# EAGLE design FTDI-Breakout_v30 (EAGLE 7.7.0)
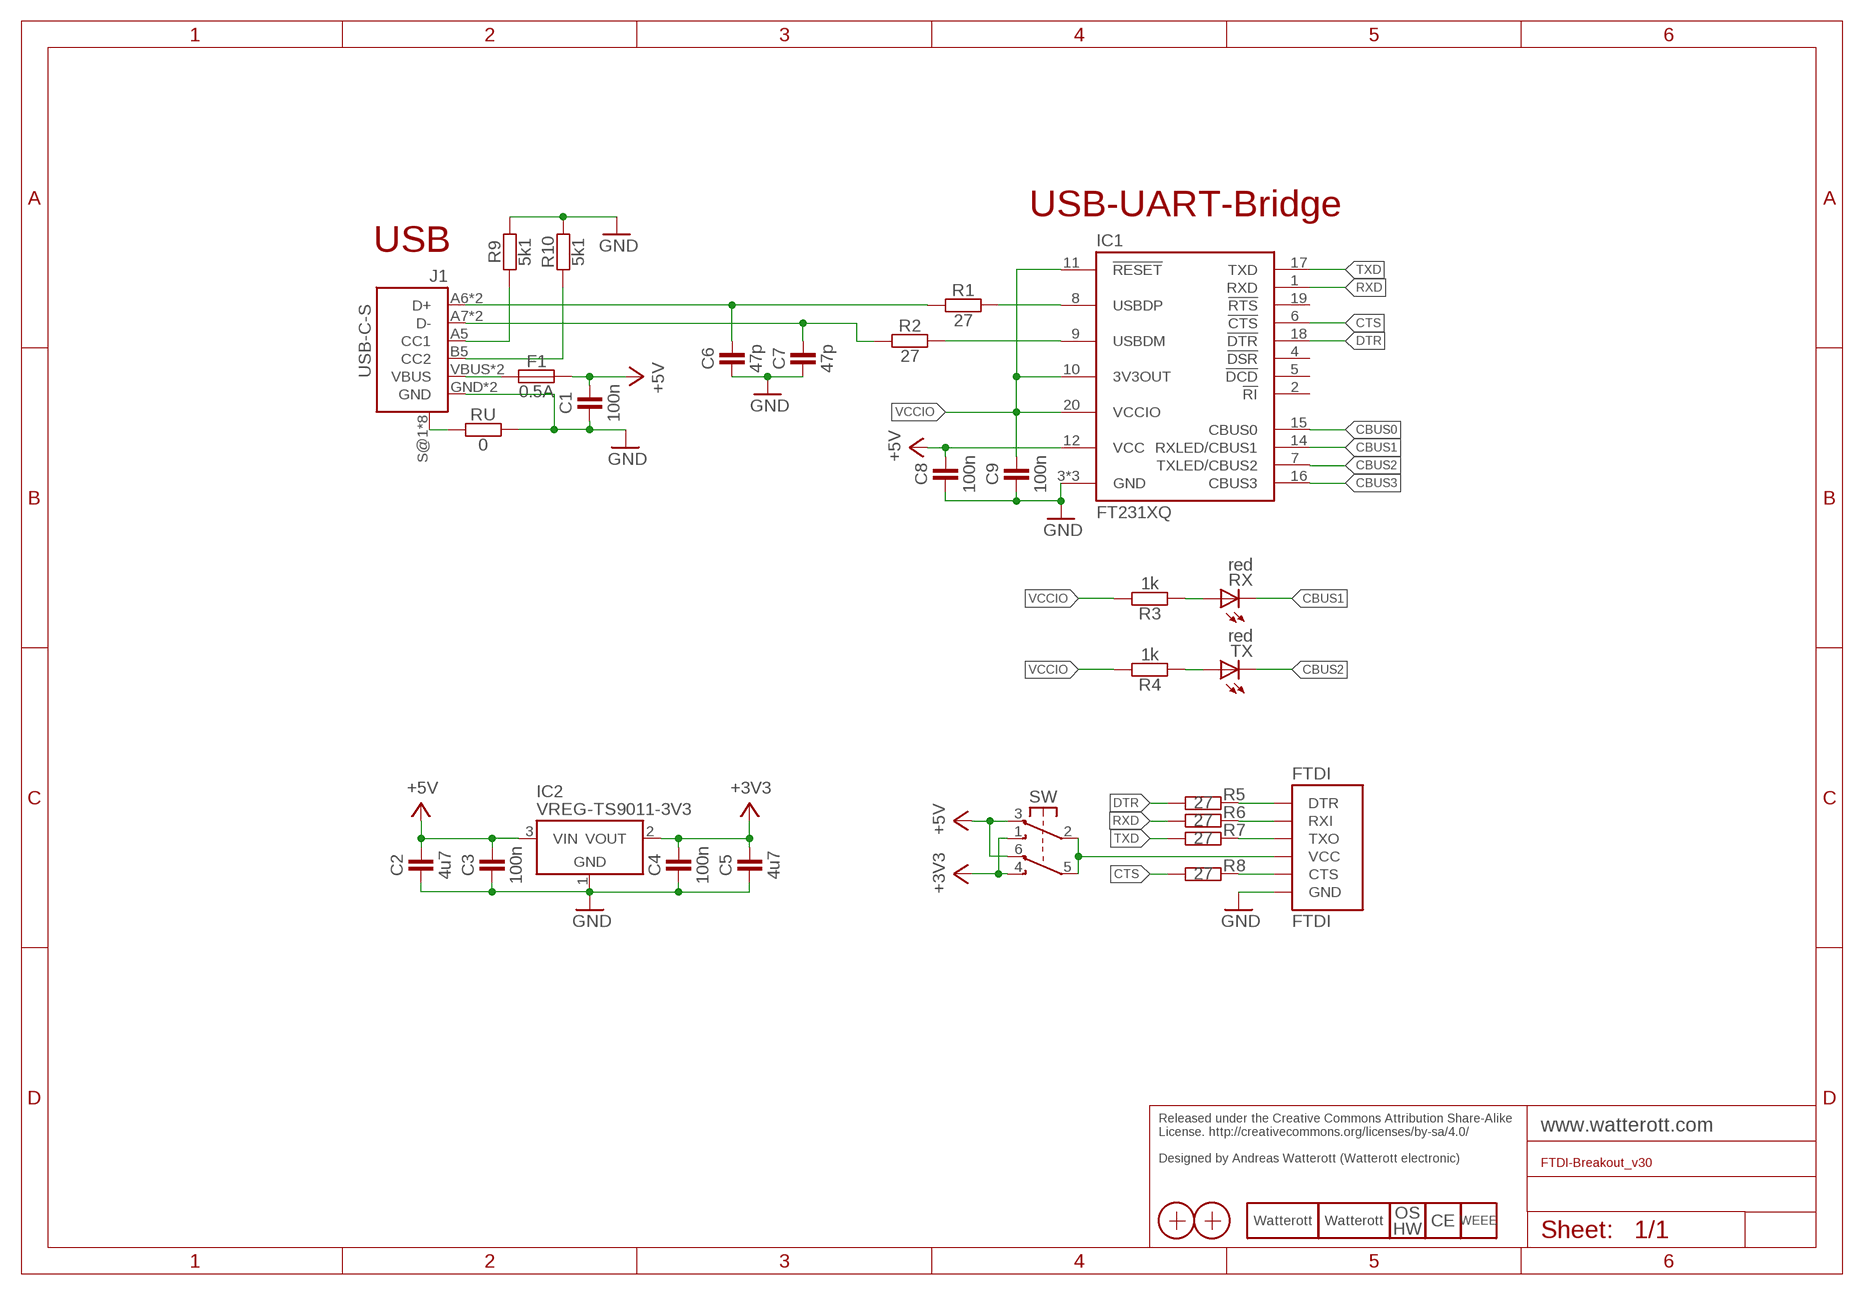
[diagram p0: schematic, sheet 1]

## Parts
C1  100n  CAPACITOR-0603  [C0603]
C2  4u7  CAPACITOR-0805  [C0805]
C3  100n  CAPACITOR-0603  [C0603]
C4  100n  CAPACITOR-0603  [C0603]
C5  4u7  CAPACITOR-0805  [C0805]
C6  47p  CAPACITOR-0603  [C0603]
C7  47p  CAPACITOR-0603  [C0603]
C8  100n  CAPACITOR-0603  [C0603]
C9  100n  CAPACITOR-0603  [C0603]
F1  0.5A  FUSE-0805  [C0805]
FTDI  FTDI  [FTDI]
IC1  FT231XQ  [QFN20-PAD]
IC2  VREG-TS9011-3V3  [SOT23]
J1  USB-C-S  [USB-C-S]
LOGO5  LOGO_SPARK-2  [SPARK_2MM]
LOGO6  LOGO_SPARK-4  [SPARK_4MM]
LOGO7  LOGO_OSHW-2  [OSHW_2MM]
LOGO8  LOGO_CE-2  [CE_2MM]
LOGO9  LOGO_WEEE-4  [WEEE_4MM]
R1  27  RESISTOR-0603  [C0603]
R2  27  RESISTOR-0603  [C0603]
R3  1k  RESISTOR-0603  [C0603]
R4  1k  RESISTOR-0603  [C0603]
R5  27  RESISTOR-0603  [C0603]
R6  27  RESISTOR-0603  [C0603]
R7  27  RESISTOR-0603  [C0603]
R8  27  RESISTOR-0603  [C0603]
R9  5k1  RESISTOR-0603  [C0603]
R10  5k1  RESISTOR-0603  [C0603]
RU  0  RESISTOR-0603  [C0603]
RX  red  LED-0603  [C0603]
SW  SW-2UM-CUS22B  [CUS22B]
TX  red  LED-0603  [C0603]
X1  PASSER-07  [PASSER_07MM]
X2  PASSER-07  [PASSER_07MM]

## Nets
+3V3: C4.2 C5.2 IC2.2(VOUT) SW.1(NO1) SW.4(NO2)
+5V: C1.2 C2.2 C3.2 C8.2 F1.2 IC1.12(VCC) IC2.3(VIN) SW.3(NC1) SW.6(NC2)
CBUS0: IC1.15(CBUS0)
CBUS1: IC1.14(RXLED/CBUS1) RX.C
CBUS2: IC1.7(TXLED/CBUS2) TX.C
CBUS3: IC1.16(CBUS3)
CC1: J1.A5(CC1) R9.1
CC2: J1.B5(CC2) R10.1
CTS: IC1.6(!CTS) R8.1
D2_N: IC1.9(USBDM) R2.2
D2_P: IC1.8(USBDP) R1.2
D_N: C7.2 J1.A7(D-) J1.B7(D-) R2.1
D_P: C6.2 J1.A6(D+) J1.B6(D+) R1.1
DTR: IC1.18(!DTR) R5.1
FTDI-CTS: FTDI.2-CTS(CTS) R8.2
FTDI-DTR: FTDI.6-DTR(DTR) R5.2
FTDI-RXI: FTDI.5-RXI(RXI) R6.2
FTDI-TXO: FTDI.4-TXO(TXO) R7.2
FTDI-VCC: FTDI.3-VCC(VCC) SW.2(C1) SW.5(C2)
GND: C1.1 C2.1 C3.1 C4.1 C5.1 C6.1 C7.1 C8.1 C9.1 FTDI.1-GND(GND) IC1.3(GND) IC1.13(GND) IC1.TP(GND) IC2.1(GND) J1.GND J1.GND2(GND) R9.2 R10.2 RU.2
RX-LED: R3.1 RX.A
RXD: IC1.1(RXD) R6.1
SHLD: J1.S@1(SHIELD) J1.S@2(SHIELD) J1.S@3(SHIELD) J1.S@4(SHIELD) J1.S@5(SHIELD) J1.S@6(SHIELD) J1.S@7(SHIELD) J1.S@8(SHIELD) RU.1
TX-LED: R4.1 TX.A
TXD: IC1.17(TXD) R7.1
VBUS: F1.1 J1.VBUS J1.VBUS2(VBUS)
VCCIO: C9.2 IC1.10(3V3OUT) IC1.11(!RESET) IC1.20(VCCIO) R3.2 R4.2
Unconnected: IC1.2(!RI) IC1.4(!DSR) IC1.5(!DCD) IC1.19(!RTS)

## Notes on the sheet
- USB-UART-Bridge
- USB
- Released under the Creative Commons Attribution Share-Alike 
  License. http://creativecommons.org/licenses/by-sa/4.0/
  
  Designed by Andreas Watterott (Watterott electronic)

## Library data of the parts
C1-C9 = we-rcl:CAPACITOR: Capacitor ...2.2uF @ 6.3V -> 0402 ...4.7uF @ 6.3V -> 0603 ...10uF @ 16V -> 0805 ...22uF @ 25V -> 1206
F1 = we-rcl:FUSE: Fuse Polyfuses 0805 - 0.5A or 1A, 6V 1206 - 2A, 6V 1812 - 1A or 2A, 16V
FTDI = we-board:FTDI: FTDI 6pol connector
IC1 = we-chip:FT231X: FTDI FT231X USB to UART Bridge (5V tolerant inputs); DIGIKEY: 768-1128-6-ND
IC2 = we-power:VREG: Voltage Regulator LDOs Taiwan Semi TS1117 800mA max 15V - compatible On Semi NCP1117 1A max 20V - compatible Diodes AP2111H 0.6A max 6V (0.25V@0.6A) - compatible Diodes AP2114H 1A max 6V (0.45V@1A) Taiwan Semi TS9011 250mA max 12V - compatible Diodes AP2210 300mA max 15V - compatible Microchip MCP1700 250mA max 6.5V - compatible Microchip MCP1702 250mA max 13V - compatible Microchip MCP1703 250mA max 16V - compatible Microchip MCP1754 150mA max 16V Taiwan Semi TS5204 80mA max 16V (low noise) DC/DC Converter Modules Recom R-78Ex.x-1.0-W36 1A max 28V - compatible CUI V78xx-2000 2A max 18V Murata OKI-78SR-x.x/1.5-W36 1.5A max 36V
J1 = we-con:USB-C: USB-C Connector Hroparts TYPE-C-31-M-12 or Jing C167321 or XKB U262-161N-4BVC11 Up: XKB U263-241N-4BQC11-1 or Wuerth 632722110112
LOGO5 LOGO6 = we-symbol:LOGO_SPARK: Watterott electronic Logo
LOGO7 = we-symbol:LOGO_OSHW: Open-Source-Hardware Logo
LOGO8 = we-symbol:LOGO_CE: CE Logo
LOGO9 = we-symbol:LOGO_WEEE: WEEE Logo
R1-R10 RU = we-rcl:RESISTOR: Resistor all kinds in 0402 and 0603
RX TX = we-opto:LED: LED red, green, blue -> 0603
SW = we-switch:SW-2UM: Switch; DIGIKEY: 563-1105-6-ND
X1 X2 = we-symbol:PASSER: Fiducial Marker

## Board
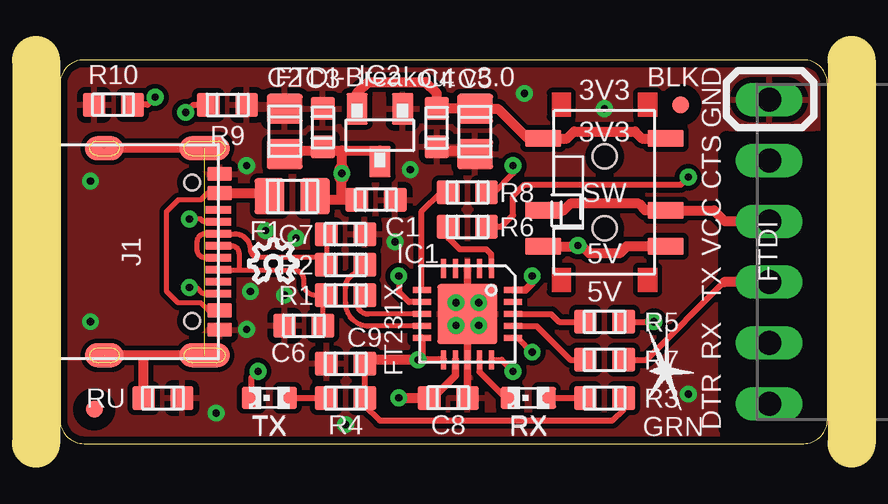
[diagram p1: board, top side]
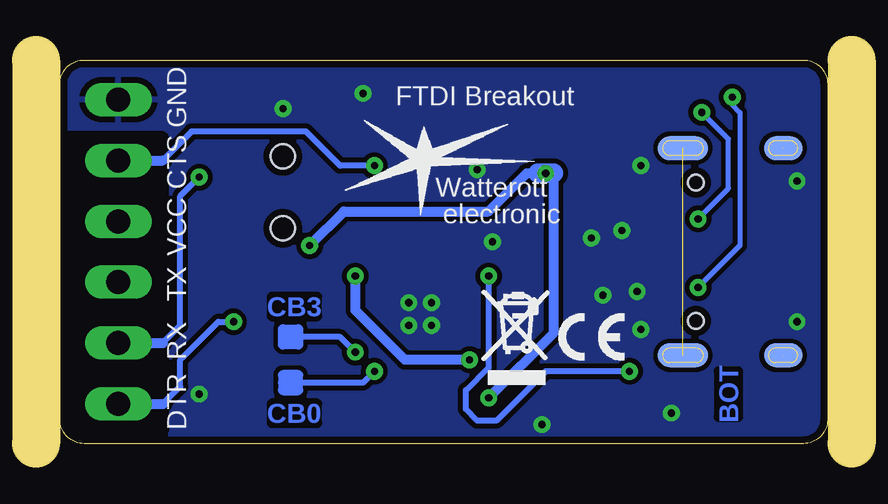
[diagram p2: board, bottom side, seen from below]

Size 32 x 16 mm. Coordinates in mm from the lower left corner, seen from the top.
Outline: 0,1 arc90 1,0 31,0 arc90 32,1 32,15 arc90 31,16 1,16 arc90 0,15 0,1
Copper layers (1*16): Top 0.035mm / dielectric 1.5mm / Bottom 0.035mm
Design rules "we-dru-2-layer *": minimum track width 0.15mm, minimum drill 0.3mm, track to track 0.15mm, track to pad 0.15mm, pad to pad 0.15mm, via to via 0.15mm, smd to smd 0.1mm, copper to edge 0.3mm, drill to drill 0.2mm, minimum pad ring 0.18mm, minimum via ring 0.2mm, stop-mask expansion 0.1mm, vias tented up to drill 0.5mm, thermal gap 0.25mm
tRestrict: area 27.8,0.6 to 31.6,12.7
bRestrict: area 27.8,0.6 to 31.6,12.7
Milling: 2 lines

### Footprints (pad centres in the part's own frame; a part is rotated, then mirrored left to right if it is on the bottom)
C0603 = smd 1 x 0.95: 1 0,0.8; 2 0,-0.8
C0805 = smd 1.5 x 1.25: 1 0,0.95; 2 0,-0.95
FTDI = drill 1 long: 1-GND 0,6.35; 2-CTS 0,3.81; 3-VCC 0,1.27; 4-TXO 0,-1.27; 5-RXI 0,-3.81; 6-DTR 0,-6.35
QFN20-PAD = smd 0.8 x 0.26: 1 -1.9,1; 2 -1.9,0.5; 3 -1.9,0; 4 -1.9,-0.5; 5 -1.9,-1; 11 1.9,-1; 12 1.9,-0.5; 13 1.9,0; 14 1.9,0.5; 15 1.9,1 | smd 0.26 x 0.8: 6 -1,-1.9; 7 -0.5,-1.9; 8 0,-1.9; 9 0.5,-1.9; 10 1,-1.9; 16 1,1.9; 17 0.5,1.9; 18 0,1.9; 19 -0.5,1.9; 20 -1,1.9 | smd 2.5 x 2.5: TP 0,0
SOT23 = smd 1.3 x 0.9: 1 -1.1,0.95; 2 -1.1,-0.95; 3 1.1,0
USB-C-S = smd 1.1 x 0.3: A5 -1.105,-1.25; A6 -1.105,-0.25; A7 -1.105,0.25; A8 -1.105,1.25; B5 -1.105,1.75; B6 -1.105,0.75; B7 -1.105,-0.75; B8 -1.105,-1.75 | smd 1 x 0.6: GND -1.155,3.25; GND2 -1.155,-3.25; VBUS -1.155,2.45; VBUS2 -1.155,-2.45 | smd 2.1 x 1: S@1 -0.53,4.32; S@5 -0.53,-4.32 | smd 2.1 x 1 bottom: S@2 -0.53,4.32; S@6 -0.53,-4.32 | smd 1.6 x 1: S@3 3.65,4.32; S@7 3.65,-4.32 | smd 1.6 x 1 bottom: S@4 3.65,4.32; S@8 3.65,-4.32 | hole 0.65: 0,-2.89; 0,2.89
C0603' = smd 0.9 x 0.8: A 0,-0.75; C 0,0.75
CUS22B = smd 0.7 x 1.5: 1 -2.25,2.55; 2 0.75,2.55; 3 2.25,2.55; 4 -2.25,-2.55; 5 0.75,-2.55; 6 2.25,-2.55 | hole 1: -1.5,0; 1.5,0
PASSER_07MM = smd 0.7 x 0.7: X 0,0

### Placement (x,y rotation side)
C1  13.18,10.16 270 top
C2  9.37,13.02 0 top
C3  10.95,13.18 0 top
C4  15.72,13.18 180 top
C5  17.3,13.02 180 top
C6  10.16,4.92 90 top
C7  11.91,8.73 270 top
C8  16.19,1.91 270 top
C9  11.91,3.33 90 top
F1  9.68,10.32 90 top
FTDI  29.56,8 0 top
IC1  16.99,5.4 270 top
IC2  13.34,12.86 270 top
J1  5.5,8 180 top
LOGO5  25.24,3.02 90 top
LOGO6  16.83,11.91 0 bottom
LOGO7  8.89,7.62 0 top
LOGO8  9.84,4.45 0 bottom
LOGO9  13.02,4.45 0 bottom
R1  11.91,6.19 90 top
R2  11.91,7.46 90 top
R3  22.7,1.91 90 top
R4  11.91,1.91 90 top
R5  22.7,5.08 90 top
R6  16.99,9.05 90 top
R7  22.7,3.49 90 top
R8  16.99,10.48 90 top
R9  6.99,14.13 90 top
R10  2.22,14.13 270 top
RU  4.29,1.91 90 top
RX  red  [C0603']  19.53,1.91 90 top
SW  22.7,10.48 270 top
TX  red  [C0603']  8.73,1.91 90 top
X1  1.43,1.43 0 top
X2  25.88,14.13 0 top

### Tracks (layer width: path | path; a pad name or v marks a point on that pad's centre or on a via)
+3V3
  Top 0.254: 20.12,12.7 SW.4
  Top 0.406: SW.4 21.14,12.73 21.43,13.02 23.97,13.02 24.26,12.73 SW.1 | 20.12,12.7 19.53,12.7 18.26,13.97 C5.2 15.72,13.97 C4.2 15.72,14.61 15.24,15.08 12.86,15.08 12.38,14.61 IC2.2
+5V  (via drill 0.3)
  Top 0.254: 10.95,12.07 10.95,12.06 10.95,12.22
  Top 0.305: IC1.12 16.49,2.83 15.56,1.91 C8.2
  Top 0.406: v14.13,1.91 C8.2 | SW.3 23.63,8.23 23.34,7.94 22.07,7.94 21.78,8.23 21.59,8.23 | C2.2 9.37,12.22 10.95,12.22 | C1.2 11.75,10.16 | 11.75,10.16 11.75,11.11 | 10.95,12.22 11.75,12.22 | 11.75,12.22 11.75,11.43 | 11.75,10.16 10.79,10.16 F1.2 | SW.6 21.59,8.23 | v21.59,8.26 21.59,8.23 | 11.75,12.22 13.34,12.22 IC2.3 | 10.95,12.22 C3.2
  Top 0.61: 11.75,11.11 v11.75,11.27 11.75,11.43
  Top 0.813: C2.2 9.37,11.91
  Bottom 0.406: 12.06,11.27 12.54,11.27 14.13,9.68 20.16,9.68 v21.59,8.26 | 11.43,11.27 11.43,4.6 v14.13,1.91
  Bottom 0.813: 11.43,11.27 v11.75,11.27 12.06,11.27
CBUS0  (via drill 0.3)
  Top 0.254: IC1.15 18.41,3.5 v18.89,3.02
  Bottom 0.254: v18.89,3.02 19.37,2.54 22.07,2.54
  Bottom 0.406: 22.7,2.54 22.7,2.86 22.07,2.86 22.07,2.54 | 22.7,2.54 22.7,2.22 22.07,2.22 22.07,2.54 | 22.07,2.54 22.7,2.54
CBUS1
  Top 0.254: IC1.14 17.49,2.99 18.57,1.91 RX.C
CBUS2  (via drill 0.3)
  Top 0.254: IC1.7 14.56,5.9 14.13,6.33 v14.13,6.99 | TX.C 7.98,2.74 v8.26,3.02
  Bottom 0.254: v14.13,6.99 14.13,3.17 15.08,2.22 15.08,1.43 14.61,0.95 13.81,0.95 11.75,3.02 v8.26,3.02
CBUS3  (via drill 0.3)
  Top 0.254: IC1.16 19.1,4.4 v19.68,3.81
  Bottom 0.254: v19.68,3.81 20.32,4.45 22.7,4.45
  Bottom 0.406: 22.07,4.76 22.07,4.13 22.7,4.13 22.7,4.45 22.7,4.76 22.07,4.76
CC1  (via drill 0.3)
  Top 0.203: J1.A5 5.99,9.25 5.87,9.37 v5.4,9.37
  Top 0.254: v5.24,13.81 5.56,14.13 R9.1
  Bottom 0.203: v5.4,9.37 4.13,10.64 4.13,12.7 v5.24,13.81
CC2  (via drill 0.3)
  Top 0.203: J1.B5 5.97,6.25 5.71,6.51 v5.4,6.51
  Top 0.254: v3.97,14.45 3.65,14.13 R10.1
  Bottom 0.203: v5.4,6.51 3.65,8.26 3.65,13.81 3.97,14.13 v3.97,14.45
CTS
  Top 0.254: IC1.6 15.09,6.5 15.08,6.51 15.08,9.68 15.88,10.48 R8.1
D2_N
  Top 0.203: IC1.9 12.88,4.9 arc-90 11.91,5.87 11.91,6.51 arc-90 12.54,7.14 12.76,7.36 12.76,7.41 R2.2
D2_P
  Top 0.203: IC1.8 12.86,5.4 arc-90 12.38,5.87 12.38,6.19 R1.2
D_N
  Top 0.203: C7.2 R2.1 11.06,7.46 10.74,7.78 8.26,7.78 arc-90 7.94,8.1 arc90 7.28,8.75 J1.B7 6.05,8.75 arc90 5.71,8.41 5.71,8.1 arc90 6.06,7.75 J1.A7
D_P
  Top 0.203: J1.A6 7.15,8.25 arc-90 7.46,7.94 7.46,7.25 | J1.B6 7.46,7.25 | 7.46,7.25 9.74,7.25 arc-90 10.16,6.83 10.16,6.67 arc90 10.64,6.19 10.95,6.19 | 10.95,6.19 R1.1 | 10.95,6.03 10.95,6.19 | C6.2 10.96,6.18 10.95,6.19
DTR
  Top 0.254: IC1.18 20.48,5.4 20.8,5.08 R5.1
FTDI-CTS  (via drill 0.3)
  Top 0.254: R8.2 18.1,10.48 18.89,11.27 v18.89,11.59
  Bottom 0.254: v18.89,11.59 20.32,11.59 21.75,13.02 26.51,13.02 27.72,11.81
  Bottom 0.406: FTDI.2-CTS 27.72,11.81
FTDI-DTR  (via drill 0.3)
  Top 0.254: R5.2 v24.77,5.08
  Bottom 0.254: 27.72,1.65 26.99,2.38 26.99,3.49 25.4,5.08 v24.77,5.08
  Bottom 0.406: FTDI.6-DTR 27.72,1.65
FTDI-RXI  (via drill 0.3)
  Top 0.254: R6.2 18.41,9.05 18.89,9.53 18.89,10.32 19.37,10.79 25.88,10.79 v26.19,11.11
  Bottom 0.254: 27.72,4.19 26.99,4.92 26.99,10.32 v26.19,11.11
  Bottom 0.406: FTDI.5-RXI 27.72,4.19
FTDI-TXO
  Top 0.254: R7.2 24.45,3.49 27.68,6.73
  Top 0.406: FTDI.4-TXO 27.68,6.73
FTDI-VCC
  Top 0.406: SW.5 21,9.73 21.27,10 24.13,10 24.4,9.73 SW.2 27.26,9.73 27.72,9.27 FTDI.3-VCC
GND  (via drill 0.3)
  Top 0.254: 16.99,4.92 IC1.TP | v16.51,4.92 16.99,4.92 | v17.46,4.92 16.99,4.92 | v16.51,5.87 16.99,5.87 v17.46,5.87
  Top 0.305: IC1.13 16.99,4.92 | IC1.3 16.99,5.87 IC1.TP | IC1.13 C8.1
  Top 0.406: C4.1 15.72,12.22 17.15,12.22 C5.1
  other vias: 14.61,11.43 9.37,6.19 13.97,8.41 9.84,8.57 22.7,13.97 26.19,2.06 19.37,14.61 11.91,0.79 6.51,1.27 7.78,11.59 7.78,4.76 1.27,5.08 1.27,10.95 8.57,8.89 7.94,6.35
  pour Top (isolate 0.203, rank 2): 0,16 32,16 32,0 0,0
  pour Bottom (isolate 0.203): 0,16 32,16 32,0 0,0
RX-LED
  Top 0.254: RX.A R3.1
RXD
  Top 0.254: IC1.1 17.99,7.89 17.78,8.1 16.67,8.1 16.19,8.57 16.19,8.99 16.19,9 R6.1
SHLD  (5 unrouted)
  Top 0.254: J1.S@8 3.02,12.32
  Top 0.406: J1.S@5 J1.S@8 | J1.S@1 3.49,3.68 | 3.49,3.68 J1.S@3 | RU.1 3.49,3.68
TX-LED
  Top 0.254: TX.A R4.1
TXD
  Top 0.254: IC1.17 19.87,4.9 21.27,3.49 R7.1
VBUS
  Top 0.203: J1.VBUS 6.2,5.55 5.87,5.87 4.92,5.87 4.45,6.35 4.45,9.68 4.92,10.16 5.87,10.16 6.16,10.45 J1.VBUS2 6.48,10.45
  Top 0.406: J1.VBUS2 8.6,10.45 F1.1
VCCIO  (via drill 0.3)
  Top 0.254: C9.2 R4.2 12.71,1.58 13.34,0.95 23.02,0.95 23.5,1.44 R3.2 | 12.76,3.5 12.76,3.49
  Top 0.305: IC1.11 15.09,3.5 15.09,3.65 | IC1.10 15.09,3.65 | v14.93,3.49 15.09,3.65 | IC1.20 19.41,6.4 19.68,6.67 v19.68,6.99
  Top 0.406: 15.09,3.5 12.76,3.5 | v14.92,3.49 v14.93,3.49 | C9.2 12.71,3.44 12.76,3.49
  Bottom 0.406: v14.92,3.49 17.62,3.49 19.68,5.56 v19.68,6.99

### Text on the board
Bottom: CB3 | BOT | CB0
tPlace: FTDI-Breakout v3.0 | BLK | 3V3 | GND | 3V3 | CTS | VCC | 5V | 7mm Spacing | TX | 5V | FT231X | RX | DTR | TX | RX | GRN
bPlace: FTDI Breakout | GND | CTS | Watterott | electronic | VCC | TX | RX | DTR
Reference: Silkscreen: 21 tPlace + 22 bPlace